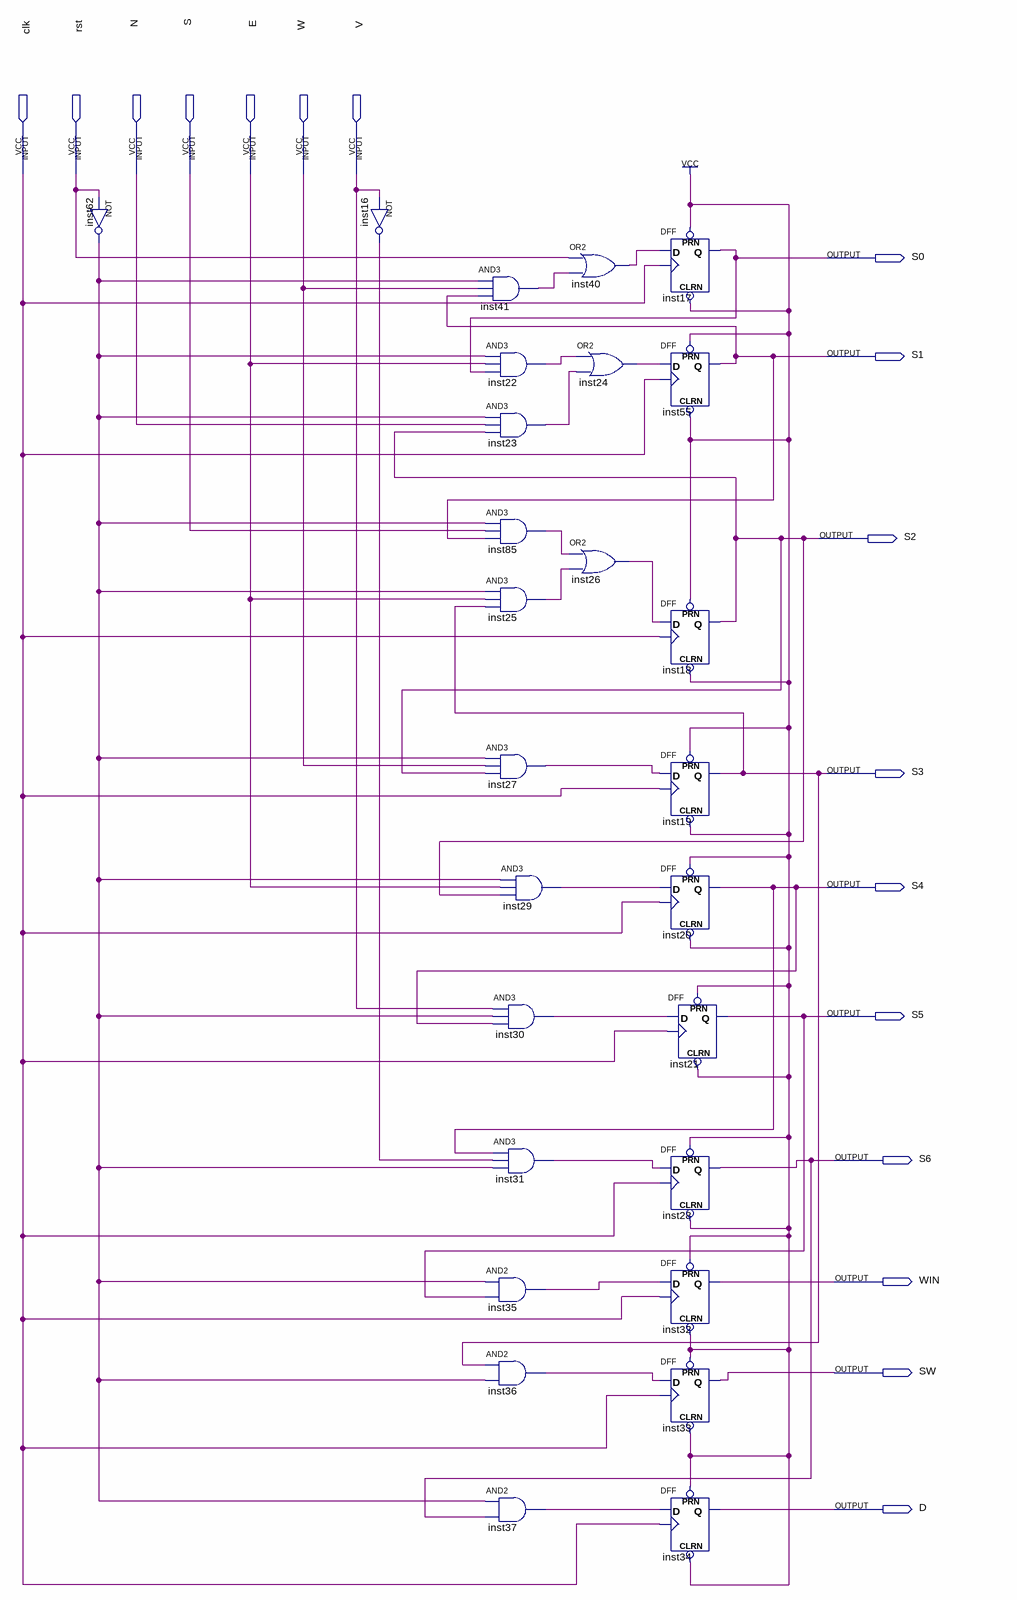
[diagram p0: schematic sheet]
// Quartus schematic Room.bdf as structural Verilog: 27 symbols, 17 pins
module Room (
  input  clk,
  input  rst,
  input  N,
  input  S,
  input  E,
  input  W,
  input  V,
  output S0,
  output S1,
  output S2,
  output S3,
  output S4,
  output S5,
  output S6,
  output WIN,
  output SW,
  output D
);

  wire inst16_out, inst22_out, inst23_out, inst24_out, inst25_out, inst26_out, inst27_out, inst29_out,
       inst30_out, inst31_out, inst35_out, inst36_out, inst37_out, inst40_out, inst41_out, inst62_out,
       inst85_out;

  not inst62 (inst62_out, rst);
  not inst16 (inst16_out, V);
  and inst41 (inst41_out, inst62_out, W, S1);
  and inst22 (inst22_out, inst62_out, E, S0);
  and inst23 (inst23_out, inst62_out, N, S2);
  and inst85 (inst85_out, inst62_out, S, S1);
  and inst25 (inst25_out, inst62_out, E, S3);
  and inst27 (inst27_out, inst62_out, W, S2);
  and inst35 (inst35_out, inst62_out, S5);
  and inst36 (inst36_out, S3, inst62_out);
  and inst37 (inst37_out, inst62_out, S6);
  and inst29 (inst29_out, inst62_out, E, S2);
  and inst30 (inst30_out, V, inst62_out, S4);
  and inst31 (inst31_out, S4, inst16_out, inst62_out);
  or inst40 (inst40_out, rst, inst41_out);
  or inst24 (inst24_out, inst22_out, inst23_out);
  or inst26 (inst26_out, inst85_out, inst25_out);
  DFF inst17 (.CLRN(1'b1), .CLK(clk), .D(inst40_out), .PRN(1'b1), .Q(S0));
  DFF inst55 (.CLRN(1'b1), .CLK(clk), .D(inst24_out), .PRN(1'b1), .Q(S1));
  DFF inst18 (.CLRN(1'b1), .CLK(clk), .D(inst26_out), .PRN(1'b1), .Q(S2));
  DFF inst19 (.CLRN(1'b1), .CLK(clk), .D(inst27_out), .PRN(1'b1), .Q(S3));
  DFF inst20 (.CLRN(1'b1), .CLK(clk), .D(inst29_out), .PRN(1'b1), .Q(S4));
  DFF inst21 (.CLRN(1'b1), .CLK(clk), .D(inst30_out), .PRN(1'b1), .Q(S5));
  DFF inst28 (.CLRN(1'b1), .CLK(clk), .D(inst31_out), .PRN(1'b1), .Q(S6));
  DFF inst32 (.CLRN(1'b1), .CLK(clk), .D(inst35_out), .PRN(1'b1), .Q(WIN));
  DFF inst33 (.CLRN(1'b1), .CLK(clk), .D(inst36_out), .PRN(1'b1), .Q(SW));
  DFF inst34 (.CLRN(1'b1), .CLK(clk), .D(inst37_out), .PRN(1'b1), .Q(D));
endmodule
